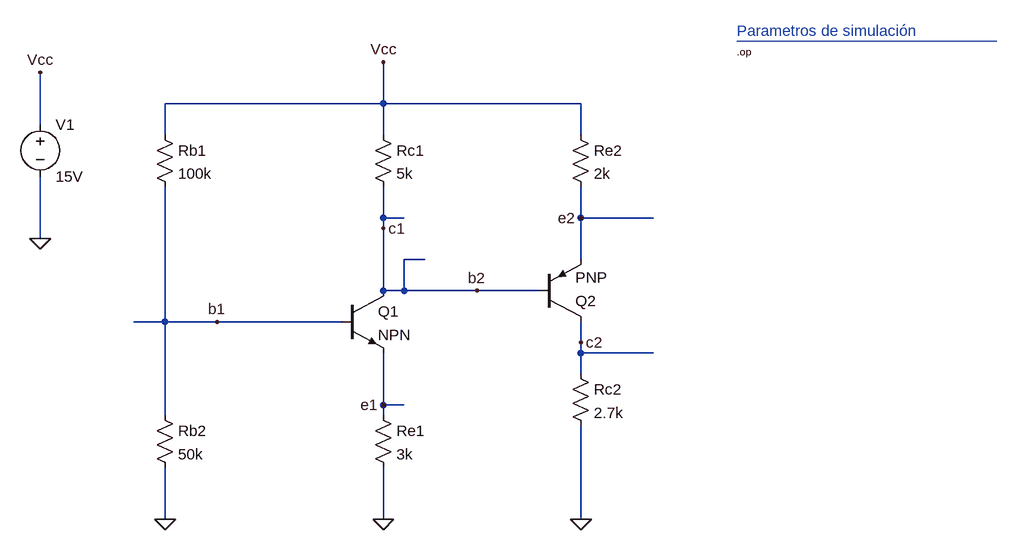
[diagram p0: schematic ejemplo_5-11.asc]
ejemplo_5-11.asc, the LTspice schematic file:
Version 4
SHEET 1 1376 680
WIRE 80 -288 80 -352
WIRE 80 -288 -256 -288
WIRE 384 -288 80 -288
WIRE -448 -256 -448 -336
WIRE -256 -240 -256 -288
WIRE 80 -240 80 -288
WIRE 384 -240 384 -288
WIRE 80 -112 80 -160
WIRE 112 -112 80 -112
WIRE 384 -112 384 -160
WIRE 496 -112 384 -112
WIRE 80 -96 80 -112
WIRE -448 -80 -448 -176
WIRE 144 -48 112 -48
WIRE 384 -48 384 -112
WIRE 80 0 80 -96
WIRE 112 0 112 -48
WIRE 112 0 80 0
WIRE 224 0 112 0
WIRE 320 0 224 0
WIRE -256 48 -256 -160
WIRE -256 48 -304 48
WIRE -176 48 -256 48
WIRE 16 48 -176 48
WIRE 384 80 384 48
WIRE 384 96 384 80
WIRE 496 96 384 96
WIRE 384 128 384 96
WIRE 80 176 80 96
WIRE 112 176 80 176
WIRE -256 192 -256 48
WIRE 80 192 80 176
WIRE -256 352 -256 272
WIRE 80 352 80 272
WIRE 384 352 384 208
FLAG 80 352 0
FLAG 80 -96 c1
FLAG 80 176 e1
FLAG -176 48 b1
FLAG 80 -352 Vcc
FLAG -448 -80 0
FLAG -256 352 0
FLAG -448 -336 Vcc
FLAG 384 352 0
FLAG 384 -112 e2
FLAG 384 80 c2
FLAG 224 0 b2
DATAFLAG 112 176 ""
DATAFLAG 112 -112 ""
DATAFLAG -160 80 "Ib(Q1)"
DATAFLAG -16 144 "Ie(Q1)"
DATAFLAG 0 -32 "Ic(Q1)"
DATAFLAG -304 48 ""
DATAFLAG 144 -48 "V(b2)"
DATAFLAG 496 -112 ""
DATAFLAG 496 96 ""
DATAFLAG 304 -64 "Ie(Q2)"
DATAFLAG 224 32 "Ib(Q2)"
DATAFLAG 288 128 "Ic(Q2)"
SYMBOL res 64 -256 R0
SYMATTR InstName Rc1
SYMATTR Value 5k
SYMBOL npn 16 0 R0
SYMATTR InstName Q1
SYMBOL voltage -448 -272 R0
SYMATTR InstName V1
SYMATTR Value 15V
SYMBOL res 64 176 R0
SYMATTR InstName Re1
SYMATTR Value 3k
SYMBOL res -272 -256 R0
SYMATTR InstName Rb1
SYMATTR Value 100k
SYMBOL res -272 176 R0
SYMATTR InstName Rb2
SYMATTR Value 50k
SYMBOL pnp 320 48 M180
SYMATTR InstName Q2
SYMBOL res 368 -256 R0
SYMATTR InstName Re2
SYMATTR Value 2k
SYMBOL res 368 112 R0
SYMATTR InstName Rc2
SYMATTR Value 2.7k
TEXT 624 -400 Left 2 ;Parametros de simulación
TEXT 624 -368 Left 1 !.op
LINE Normal 1024 -384 624 -384
LINE Normal 1024 -384 1024 -384 2
LINE Normal 1024 -384 1024 -384 2

The netlist it stands for:
* ejemplo_5-11.asc
Rc1 Vcc b2 5k
Q1 b2 b1 e1 0 NPN
V1 Vcc 0 15V
Re1 e1 0 3k
Rb1 Vcc b1 100k
Rb2 b1 0 50k
Q2 c2 b2 e2 0 PNP
Re2 Vcc e2 2k
Rc2 c2 0 2.7k
.model NPN NPN
.model PNP PNP
.lib standard.bjt
* Parametros de simulación
.op
.backanno
.end